# Altium schematic sheet 05_Mechanicals.SchDoc: Mechanicals
size A; Revision: A; SheetNumber: 5; SheetTotal: 8; ECE315_Project_Name: ECE453 Processor Mezzanine
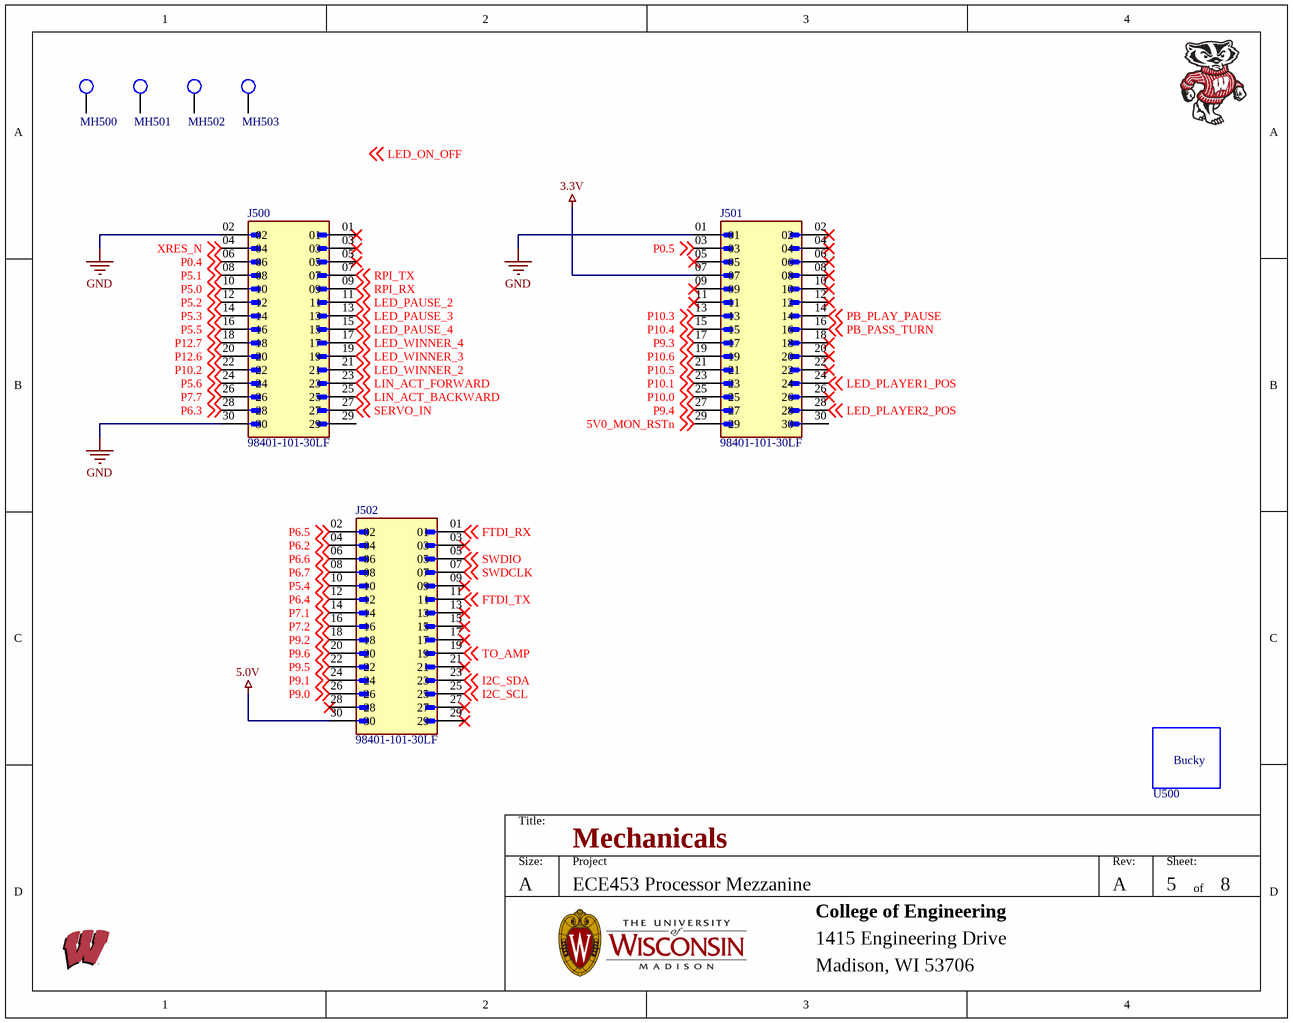
[diagram p0: 05_Mechanicals.SchDoc]

## Parts
J500  98401-101-30LF  [AMPHENOL_98401-101-30LF]
J501  98401-101-30LF  [AMPHENOL_98401-101-30LF]
J502  98401-101-30LF  [AMPHENOL_98401-101-30LF]
MH500  MHOLE_2_55MM  [MHOLE_2_55MM]  (value not drawn)  (no BOM)
MH501  MHOLE_2_55MM  [MHOLE_2_55MM]  (value not drawn)  (no BOM)
MH502  MHOLE_2_55MM  [MHOLE_2_55MM]  (value not drawn)  (no BOM)
MH503  MHOLE_2_55MM  [MHOLE_2_55MM]  (value not drawn)  (no BOM)
U500  Bucky  [WalkingBucky]  (value not drawn)  (no BOM)

## Nets
3.3V: J501.07
5.0V: J502.30
GND: J500.02 J500.30 J501.01
5V0_MON_RSTn: J501.29 ; off-sheet 5V0_MON_RSTn
FTDI_RX: J502.01 ; off-sheet FTDI_RX
FTDI_TX: J502.11 ; off-sheet FTDI_TX
I2C_SCL: J502.25 ; off-sheet I2C_SCL
I2C_SDA: J502.23 ; off-sheet I2C_SDA
LED_PAUSE_2: J500.11 ; off-sheet LED_PAUSE_2
LED_PAUSE_3: J500.13 ; off-sheet LED_PAUSE_3
LED_PAUSE_4: J500.15 ; off-sheet LED_PAUSE_4
LED_PLAYER1_POS: J501.24 ; off-sheet LED_PLAYER1_POS
LED_PLAYER2_POS: J501.28 ; off-sheet LED_PLAYER2_POS
LED_WINNER_2: J500.21 ; off-sheet LED_WINNER_2
LED_WINNER_3: J500.19 ; off-sheet LED_WINNER_3
LED_WINNER_4: J500.17 ; off-sheet LED_WINNER_4
LIN_ACT_BACKWARD: J500.25 ; off-sheet LIN_ACT_BACKWARD
LIN_ACT_FORWARD: J500.23 ; off-sheet LIN_ACT_FORWARD
P0.4: J500.06 ; off-sheet P0.4
P0.5: J501.03 ; off-sheet P0.5
P5.0: J500.10 ; off-sheet P5.0
P5.1: J500.08 ; off-sheet P5.1
P5.2: J500.12 ; off-sheet P5.2
P5.3: J500.14 ; off-sheet P5.3
P5.4: J502.10 ; off-sheet P5.4
P5.5: J500.16 ; off-sheet P5.5
P5.6: J500.24 ; off-sheet P5.6
P6.2: J502.04 ; off-sheet P6.2
P6.3: J500.28 ; off-sheet P6.3
P6.4: J502.12 ; off-sheet P6.4
P6.5: J502.02 ; off-sheet P6.5
P6.6: J502.06 ; off-sheet P6.6
P6.7: J502.08 ; off-sheet P6.7
P7.1: J502.14 ; off-sheet P7.1
P7.2: J502.16 ; off-sheet P7.2
P7.7: J500.26 ; off-sheet P7.7
P9.0: J502.26 ; off-sheet P9.0
P9.1: J502.24 ; off-sheet P9.1
P9.2: J502.18 ; off-sheet P9.2
P9.3: J501.17 ; off-sheet P9.3
P9.4: J501.27 ; off-sheet P9.4
P9.5: J502.22 ; off-sheet P9.5
P9.6: J502.20 ; off-sheet P9.6
P10.0: J501.25 ; off-sheet P10.0
P10.1: J501.23 ; off-sheet P10.1
P10.2: J500.22 ; off-sheet P10.2
P10.3: J501.13 ; off-sheet P10.3
P10.4: J501.15 ; off-sheet P10.4
P10.5: J501.21 ; off-sheet P10.5
P10.6: J501.19 ; off-sheet P10.6
P12.6: J500.20 ; off-sheet P12.6
P12.7: J500.18 ; off-sheet P12.7
PB_PASS_TURN: J501.16 ; off-sheet PB_PASS_TURN
PB_PLAY_PAUSE: J501.14 ; off-sheet PB_PLAY_PAUSE
RPI_RX: J500.09 ; off-sheet RPI_RX
RPI_TX: J500.07 ; off-sheet RPI_TX
SERVO_IN: J500.27 ; off-sheet SERVO_IN
SWDCLK: J502.07 ; off-sheet SWDCLK
SWDIO: J502.05 ; off-sheet SWDIO
TO_AMP: J502.19 ; off-sheet TO_AMP
XRES_N: J500.04 ; off-sheet XRES_N

Not connected (* = marked no-connect by the designer): J500 01* 03* 05* 29; J501 02* 04* 05* 06* 08* 09* 10* 11* 12* 18* 20* 22* 26* 30; J502 03* 09* 13* 15* 17* 21* 27* 28* 29*; MH500 1; MH501 1; MH502 1; MH503 1

## Notes on the sheet
- Labels drawn without touching a wire or pin: LED_ON_OFF
- Title:
- Size:
- A
- Project
- Rev:
- Sheet:
- of
- College of Engineering
- 1415 Engineering Drive
- Madison, WI 53706

## Library data of the parts
J500-J502 = 98401-101-30LF: Conn Unshrouded Header HDR 30 POS 2.54mm Solder ST SMD T/R; Manufacturer 1: Amphenol ICC / FCI; Manufacturer Part Number: 95278-101A30LF; MF: Amphenol ICC (FCI); Number of Contacts: 30; Max Voltage Rating (AC): 1.5kV; Current Rating: 3A; Insulation Resistance: 5GR; Row Spacing: 0.1inch; Gender: Male; Package: None; Price: None; Value: *; MP: 98401-101-30LF; Availability: Unavailable; Supplier 1: Digi-Key; Supplier Part Number 1: 98401-101-30LF-ND; Manufacturer Part Number 1: 98401-101-30LF; RoHS: Yes; Category: Headers and Wire Housings; Pricing 1: 400=1.30895 (USD); Mount: Surface Mount; Contact Plating: Gold,GXT; Contact Material: Bronze; Color: Black; Housing Color: Black; Housing Material: Thermoplastic; Min Operating Temperature: -65°C; Max Operating Temperature: 125°C; Number of Rows: 2; Termination: Solder; Package Quantity: 200; Packaging: Bulk; Number of Positions: 30; Orientation: Straight; Series: BERGSTIK®, MezzSelect™, Basics+; Voltage Rating: 1.5kV; Contact Gender: Male; Contact Type: Male Pin; Length: 38.1mm; Pitch: 2.54mm; Depth: 4.83mm; Contact Mating Length: 0.23inch; RoHS Compliant: Yes; Flammability Rating: UL94 V-0; ComponentLink1URL: https://datasheet.ciiva.com/5168/98401-274167-5168660.pdf?src-supplier=Mouser; ComponentLink1Description: https://datasheet.ciiva.com/5168/98401-274167-5168660.pdf?src-supplier=Mouser; ComponentLink2URL: https://datasheet.ciiva.com/10120/98401-10120570.pdf?src-supplier=Avnet; ComponentLink2Description: https://datasheet.ciiva.com/10120/98401-10120570.pdf?src-supplier=Avnet; ComponentLink3URL: https://datasheet.ciiva.com/724/98401-724961.pdf?src-supplier=Digi-Key; ComponentLink3Description: https://datasheet.ciiva.com/724/98401-724961.pdf?src-supplier=Digi-Key; Supplier: Newark; Supplier Part Number: 63K1615; Manufacturer: Amphenol ICC / FCI; Pricing: 370=1.45, 1000=1.44, 2000=1.39, 4000=1.32, 6000=1.3, 10000=1.28 (USD); Mounting Technology: Surface Mount; ComponentLink4URL: https://datasheet.ciiva.com/724/95278-724949.pdf?src-supplier=Digi-Key; ComponentLink4Description: https://datasheet.ciiva.com/724/95278-724949.pdf?src-supplier=Digi-Key
MH500-MH503 = MHOLE_2_55MM: Mounting Holde; Manufacturer Part Number: UW MTHOLE
U500 = Bucky: Bucky Badger Image; Manufacturer Part Number: UW Bucky